# EAGLE design PowerMeterShield (EAGLE 6.5.0)
Assembly variants: ISOLATED, NONISOLATED
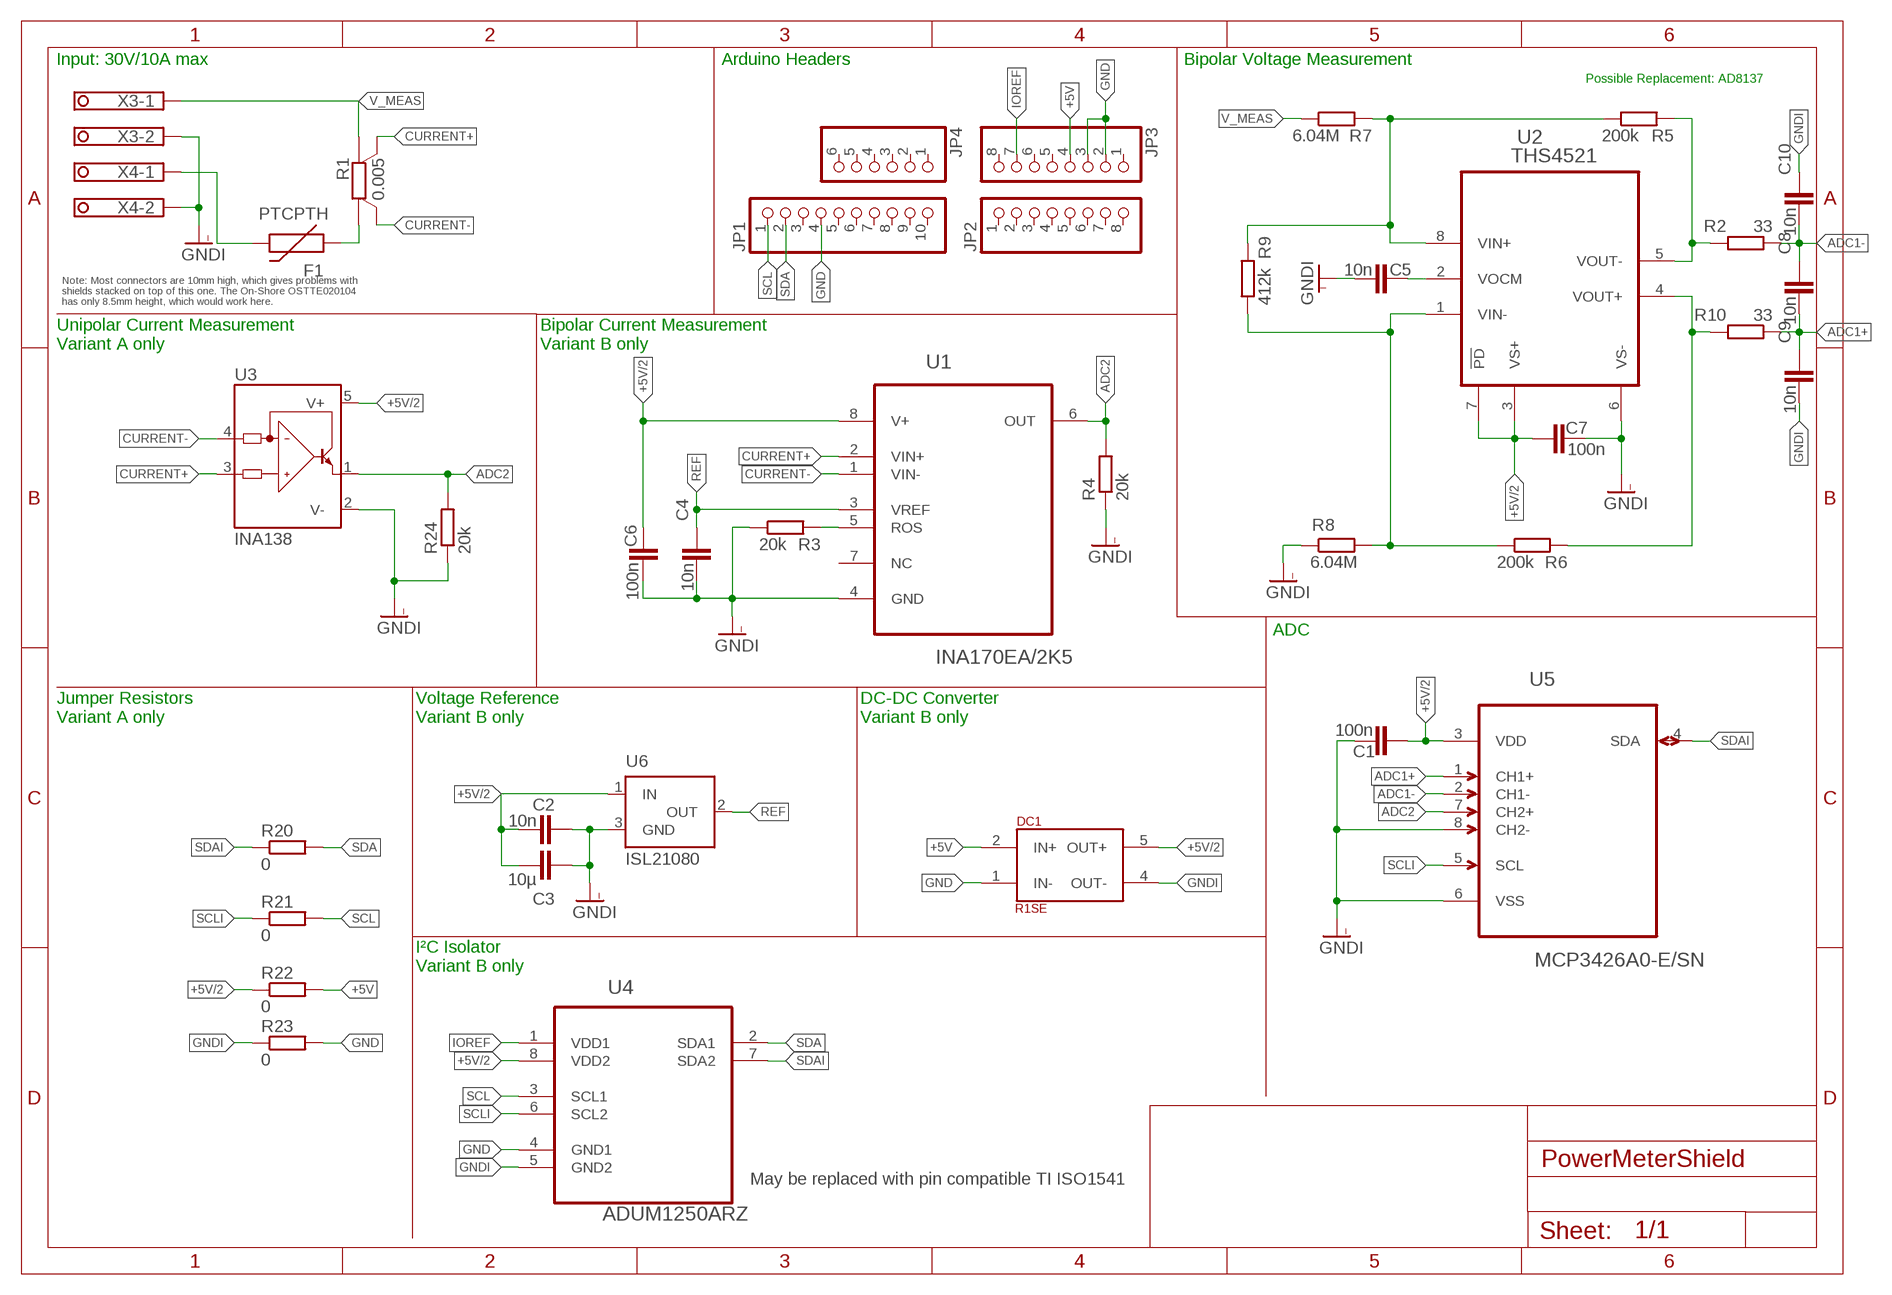
[diagram p0: schematic, sheet 1]

## Parts
C1  100n  C-EUC0805  [C0805]
C2  10n  C-EUC0805  [C0805]  (not fitted in variant NONISOLATED)
C3  10µ  C-EUC0805  [C0805]  (not fitted in variant NONISOLATED)
C4  10n  C-EUC0805  [C0805]  (not fitted in variant NONISOLATED)
C5  10n  C-EUC0805  [C0805]
C6  100n  C-EUC0805  [C0805]  (not fitted in variant NONISOLATED)
C7  100n  C-EUC0805  [C0805]
C8  10n  C-EUC0805  [C0805]
C9  10n  C-EUC0805  [C0805]
C10  10n  C-EUC0805  [C0805]
DC1  R1SE  [R1SE]  (not fitted in variant NONISOLATED)
F1  PTCPTH  [PTC]
JP1  PINHD-1X10  [1X10]
JP2  PINHD-1X8  [1X08]
JP3  PINHD-1X8  [1X08]
JP4  PINHD-1X6  [1X06]
R1  0.005  SHUNT-4CSM3675M  [CSM3637M]
R2  33  R-EU_R0805  [R0805]
R3  20k  R-EU_R0805  [R0805]  (not fitted in variant NONISOLATED)
R4  20k  R-EU_R0805  [R0805]  (not fitted in variant NONISOLATED)
R5  200k  R-EU_R0805  [R0805]
R6  200k  R-EU_R0805  [R0805]
R7  6.04M  R-EU_R0805  [R0805]
R8  6.04M  R-EU_R0805  [R0805]
R9  412k  R-EU_R0805  [R0805]
R10  33  R-EU_R0805  [R0805]
R20  0  R-EU_R2010  [R2010]  (not fitted in variant ISOLATED)
R21  0  R-EU_R2010  [R2010]  (not fitted in variant ISOLATED)
R22  0  R-EU_R2010  [R2010]  (not fitted in variant ISOLATED)
R23  0  R-EU_R2010  [R2010]  (not fitted in variant ISOLATED)
R24  20k  R-EU_R0805  [R0805]  (not fitted in variant ISOLATED)
U1  INA170EA/2K5  [SOP65P490X110-8N]  (not fitted in variant NONISOLATED)
U2  THS4521  THS4531AID  [SOIC127P600X175-8N]
U3  INA138  [SOT23-5]  (not fitted in variant ISOLATED)
U4  ADUM1250ARZ  [SOIC127P600X175-8N]  (not fitted in variant NONISOLATED)
U5  MCP3426A0-E/SN  [SOIC127P600X175-8N]
U6  ISL21080  MAX6520  [SOT23]  (not fitted in variant NONISOLATED)
X3  1751248  [1751248]
X4  1751248  [1751248]

## Nets
+5V: DC1.2(IN+) JP3.4 R22.2
+5V/2: C1.1 C2.1 C3.1 C6.1 C7.1 DC1.5(OUT+) R22.1 U1.8(V+) U2.3(VS+) U2.7(!PD) U3.5(V+) U4.8(VDD2) U5.3(VDD) U6.1(IN)
ADC1+: C8.1 C9.2 R10.1 U5.1(CH1+)
ADC1+_OLD: R6.2 R10.2 U2.4(VOUT+)
ADC1-: C8.2 C10.1 R2.1 U5.2(CH1-)
ADC1-_OLD: R2.2 R5.2 U2.5(VOUT-)
ADC2: R4.2 R24.2 U1.6(OUT) U3.1(OUT) U5.7(CH2+)
CURRENT+: R1.S2 U1.2(VIN+) U3.3(IN+)
CURRENT-: R1.S1 U1.1(VIN-) U3.4(IN-)
GND: DC1.1(IN-) JP1.4 JP3.2 JP3.3 R23.2 U4.4(GND1)
GNDI: C1.2 C2.2 C3.2 C4.1 C5.1 C6.2 C7.2 C9.1 C10.2 DC1.4(OUT-) R3.1 R4.1 R8.1 R23.1 R24.1 U1.4(GND) U2.6(VS-) U3.2(V-) U4.5(GND2) U5.6(VSS) U5.8(CH2-) U6.3(GND) X3.2 X4.2
IOREF: JP3.7 U4.1(VDD1)
N$1: C5.2 U2.2(VOCM)
N$2: R5.1 R7.2 R9.2 U2.8(VIN+)
N$3: F1.P$1 R1.I1
N$7: R3.2 U1.5(ROS)
N$10: R6.1 R8.2 R9.1 U2.1(VIN-)
REF: C4.2 U1.3(VREF) U6.2(OUT)
SCL: JP1.1 R21.2 U4.3(SCL1)
SCLI: R21.1 U4.6(SCL2) U5.5(SCL)
SDA: JP1.2 R20.2 U4.2(SDA1)
SDAI: R20.1 U4.7(SDA2) U5.4(SDA)
V_MEAS [highpower]: R1.I2 R7.1 X3.1
VIN_MEAS [highpower]: F1.P$2 X4.1
Unconnected: JP1.3 JP1.5 JP1.6 JP1.7 JP1.8 JP1.9 JP1.10 JP2.1 JP2.2 JP2.3 JP2.4 JP2.5 JP2.6 JP2.7 JP2.8 JP3.1 JP3.5 JP3.6 JP3.8 JP4.1 JP4.2 JP4.3 JP4.4 JP4.5 JP4.6 U1.7(NC)

## Notes on the sheet
- Input: 30V/10A max | Arduino Headers | Bipolar Voltage Measurement
- Possible Replacement: AD8137
- Note: Most connectors are 10mm high, which gives problems with
  shields stacked on top of this one. The On-Shore OSTTE020104
  has only 8.5mm height, which would work here.
- Unipolar Current Measurement
  Variant A only
- Bipolar Current Measurement
  Variant B only
- ADC
- Jumper Resistors
  Variant A only
- Voltage Reference
  Variant B only
- DC-DC Converter
  Variant B only
- I²C Isolator
  Variant B only
- May be replaced with pin compatible TI ISO1541

## Library data of the parts
C1-C10 = rcl:C-EU: CAPACITOR, European symbol; OC_FARNELL: 2310707; PRICE_100: 0.005
DC1 = R1SE:R1SE; OC_DIGIKEY: 945-1659-1-ND; PRICE_10: 3.08; PRICE_100: 2.82
F1 = SparkFun:PTC: Resettable Fuse PTC Resettable Fuse. Spark Fun Electronics SKU : COM-08357; OC_DIGIKEY: RGEF1000-ND; PRICE_10: 0.59; PRICE_100: 0.53
JP1 = pinhead:PINHD-1X10: PIN HEADER; OC_ELECTRODRAGON: CCO3507; PRICE_10: 0.16; PRICE_100: 0.16
JP2 JP3 = pinhead:PINHD-1X8: PIN HEADER; OC_ELECTRODRAGON: CCO3509; PRICE_10: 0.12; PRICE_100: 0.12
JP4 = pinhead:PINHD-1X6: PIN HEADER; OC_ELECTRODRAGON: CCO3510; PRICE_10: 0.12; PRICE_100: 0.12
R1 = R-Vishay:SHUNT-4; OC_FARNELL: 1107419RL; PRICE_10: 0.90; PRICE_100: 0.78
R2 R9 R10 = rcl:R-EU_: RESISTOR, European symbol; OC_DIGIKEY: 311-412KCRCT-ND; PRICE_10: 0.015; PRICE_100: 0.0071
R3 R4 R24 = rcl:R-EU_: RESISTOR, European symbol; OC_FARNELL: 2129219; PRICE_5000: 0.001
R5 R6 = rcl:R-EU_: RESISTOR, European symbol; OC_FARNELL: 2129299; PRICE_5000: 0.001
R7 = rcl:R-EU_: RESISTOR, European symbol; OC_DIGIKEY: 311-6.04MCRCT-ND; PRICE_10: 0.013; PRICE_100: 0.008
R8 = rcl:R-EU_: RESISTOR, European symbol; OC_DIGIKEY: 311-6.04MCRCT-ND; PRICE_10: 0.013; PRICE_100: 0.0083
R20 = rcl:R-EU_: RESISTOR, European symbol; OC_DIGIKEY: 1276-5994-1-ND; OC_TME: SMD2010-0R; PRICE_10: 0.08; PRICE_100: 0.034
R21 R22 = rcl:R-EU_: RESISTOR, European symbol; OC_DIGIKEY: 1276-5994-1-ND; PRICE_10: 0.082; PRICE_100: 0.034
R23 = rcl:R-EU_: RESISTOR, European symbol; OC_DIGIKEY: 1276-5994-1-ND; PRICE_10: 0.082; PRICE_100: 0.032
U1 = INA170:INA170EA/2K5: Bidirectional CURRENT SHUNT MONITOR; MPN: INA170EA/2K5; OC_DIGIKEY: INA170EA/2K5CT-ND; OC_FARNELL: 1234851; OC_NEWARK: 74C9832; PACKAGE: MSOP-8; PRICE_10: 1.85; PRICE_100: 0.92; REMARK: USE DIGIKEY FOR 100; SUPPLIER: Texas Instruments
U2 = THS4531:THS4531AID: Ultra Low Power, Rail-to-Rail Output, Fully-Differential Amplifier,SOIC-8; MPN: THS4531AID; OC_DIGIKEY: 296-35973-1-ND; OC_FARNELL: 1755708; OC_NEWARK: 55W7338; PACKAGE: SOIC- 8; PRICE_10: 1.81; PRICE_100: 1.17; REMARK: USE DIGIKEY FOR 100; SUPPLIER: TEXAS INSTRUMENTS
U3 = burr-brown:INA138: High-Side Measurement Current Shunt Monitor; MF: TEXAS INSTRUMENTS; MPN: INA138NA/250; OC_DIGIKEY: 296-17936-1-ND; OC_FARNELL: 1564888; OC_NEWARK: 80K5906; PRICE_10: 1.15; PRICE_100: 0.63; REMARK: USE DIGIKEY FOR 100
U4 = Adum1250:ADUM1250ARZ: Hot Swappable, Dual I2C Isolators; MPN: ADUM1250ARZ; OC_DIGIKEY: 296-34872-1-ND; OC_FARNELL: 1814353; OC_NEWARK: 27M9880; PACKAGE: SOIC-8; PRICE_10: 3.33; PRICE_100: 1.74; SUPPLIER: Analog Devices
U5 = MCP3428:MCP3426A0-E/SN: Analog-to-Digital Converter; MPN: MCP3426A0-E/SN; OC_DIGIKEY: MCP3426A0-E/SN-ND; OC_FARNELL: 1825012; OC_NEWARK: 52R9954; PACKAGE: SOIC-8; PRICE_10: 2.06; PRICE_100: 1.58; SUPPLIER: Microchip
U6 = maxim:MAX6520: 1.2V Voltage Reference 50ppm/°C, SOT23, 3-Terminal Source: Data sheet <http://datasheets.maxim-ic.com/en/ds/MAX6520.pdf>; MF: MAXIM; MPN: MAX6520EUR-T; OC_DIGIKEY: ISL21080DIH310Z-TKCT-ND; OC_FARNELL: unknown; OC_NEWARK: 02J4586; PRICE_10: 1.35; PRICE_100: 0.81
X3 X4 = con-phoenix-350:1751248: MKDS 1/ 2-3,5 Printklemme Nennstrom: 10 A Bemessungsspannung: 160 V Raster: 3,5 mm Polzahl: 2 Montageart: Löten Anschlussart: Schraubanschluss Anschlussrichtung vom Leiter zur Platine: 0° Source: http://eshop.phoenixcontact.com .. 1751248.pdf; OC_DIGIKEY: ED2740-ND; OC_FARNELL: unknown; OC_NEWARK: unknown; PRICE_10: 0.27; PRICE_100: 0.19

## Net classes
1 highpower: width 0.305 mm, clearance 0.381 mm
2 isolated: clearance 20 mm

## Board
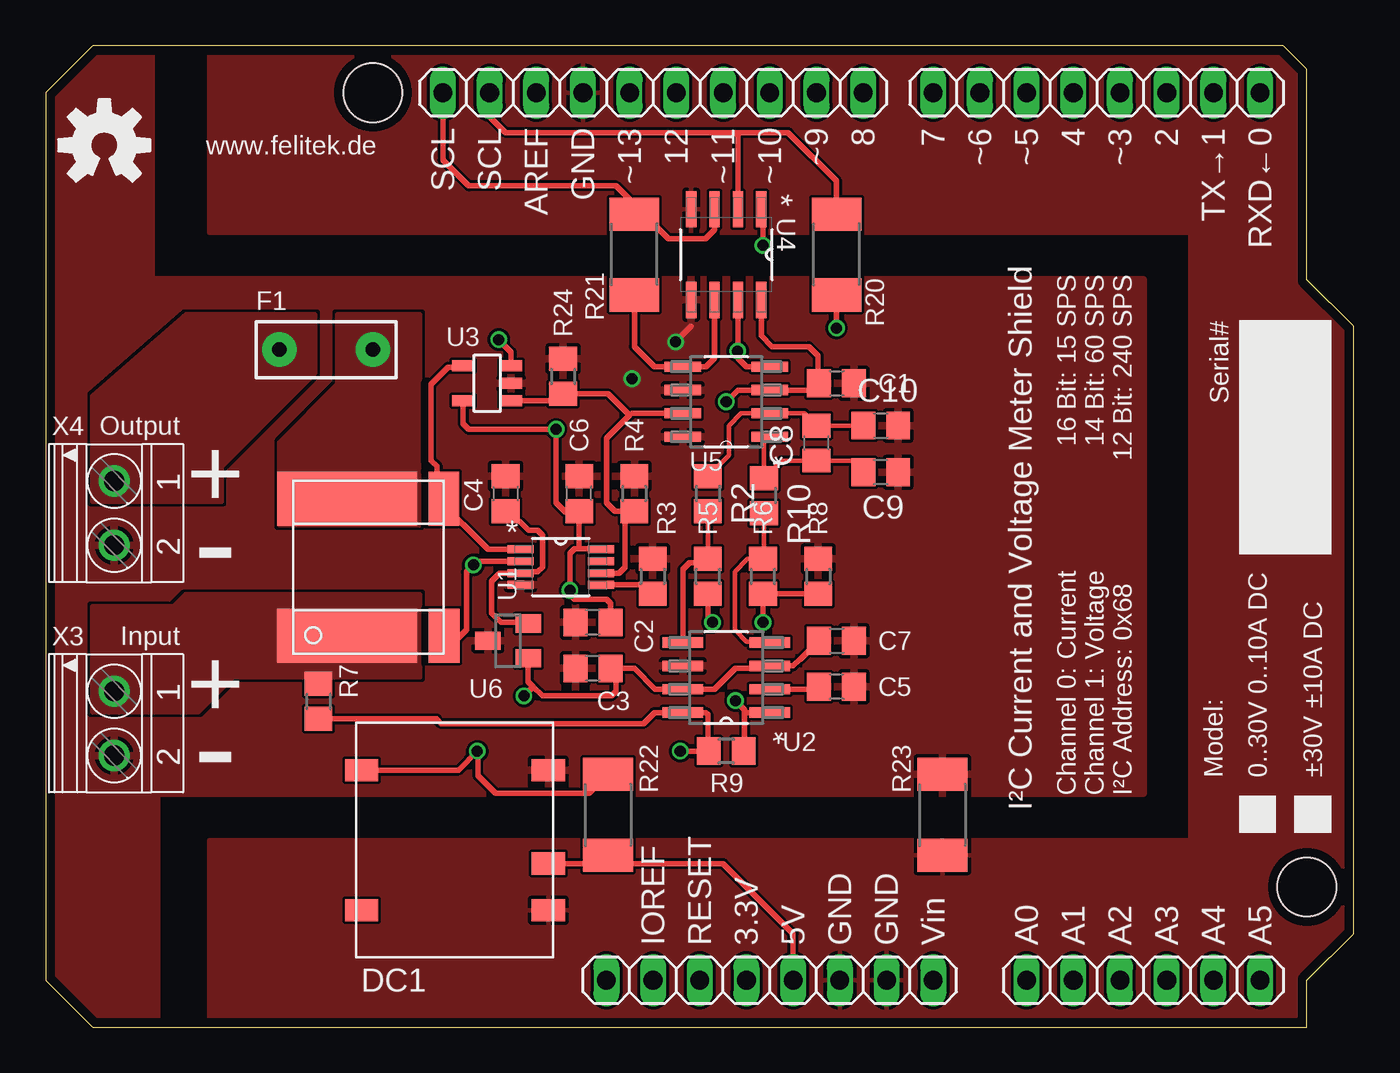
[diagram p1: board, top side]
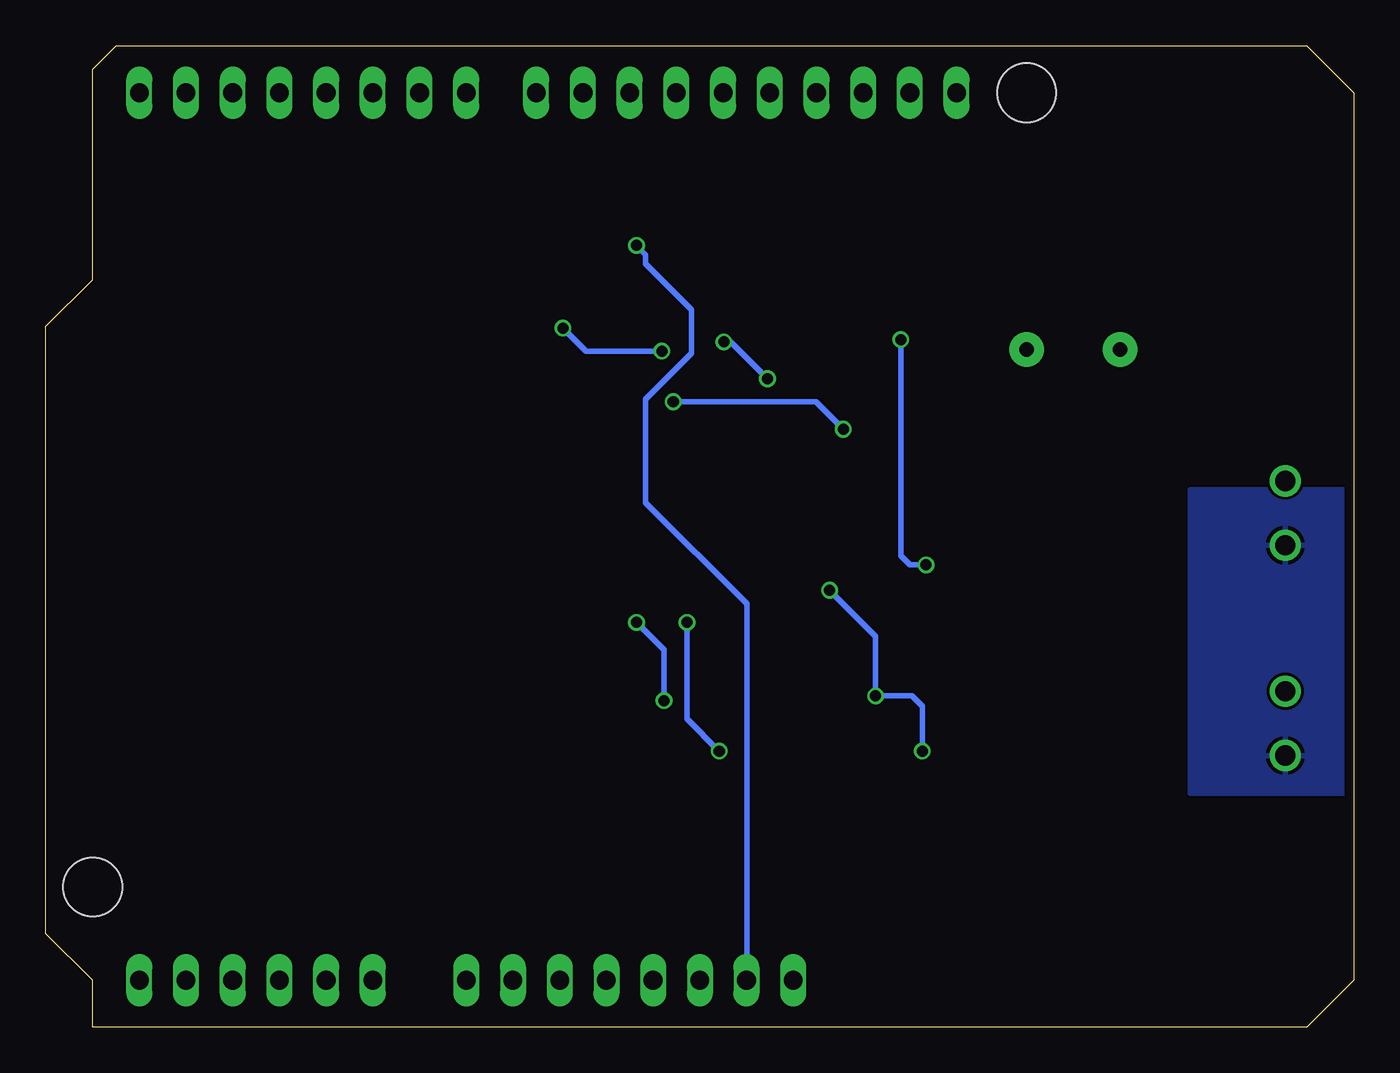
[diagram p2: board, bottom side, seen from below]

Size 71.12 x 53.34 mm. Coordinates in mm from the lower left corner, seen from the top.
Outline: 2.54,0 68.58,0 68.58,2.54 71.12,5.08 71.12,38.1 68.58,40.64 68.58,52.07 67.31,53.34 2.54,53.34 0,50.8 0,2.54 2.54,0
Copper layers (1*16): Top 0.035mm / dielectric 1.5mm / Bottom 0.035mm
Design rules "aetzwerk *": minimum track width 6mil, minimum drill 12mil, track to track 6mil, track to pad 6mil, pad to pad 6mil, via to via 6mil, smd to smd 6mil, copper to edge 20mil, drill to drill 8mil, minimum pad ring 8mil, minimum via ring 6mil, stop-mask expansion 3mil, vias tented up to drill 0mil, thermal gap 8mil
Holes 3.2 mm at 17.78,50.8 68.58,7.62
bKeepout: area 0,32.4 to 9.5,43.8; area 0,3.2 to 11.4,12.1

### Footprints (pad centres in the part's own frame; a part is rotated, then mirrored left to right if it is on the bottom)
C0805 = smd 1.3 x 1.5: 1 -0.95,0; 2 0.95,0
R1SE = smd 1.2 x 1.8: 1 -3.81,-5.1; 2 -1.27,-5.1; 4 3.81,-5.1; 5 3.81,5.06; 8 -3.81,5.06
PTC = drill 0.8 pad 1.88: P$1 -2.54,0; P$2 2.54,0
1X10 = drill 1.016 long: 1 -11.43,0; 2 -8.89,0; 3 -6.35,0; 4 -3.81,0; 5 -1.27,0; 6 1.27,0; 7 3.81,0; 8 6.35,0; 9 8.89,0; 10 11.43,0
1X08 = drill 1.016 long: 1 -8.89,0; 2 -6.35,0; 3 -3.81,0; 4 -1.27,0; 5 1.27,0; 6 3.81,0; 7 6.35,0; 8 8.89,0
1X06 = drill 1.016 long: 1 -6.35,0; 2 -3.81,0; 3 -1.27,0; 4 1.27,0; 5 3.81,0; 6 6.35,0
CSM3637M = smd 7.62 x 2.95: I1 -1.15,3.725; I2 -1.15,-3.725 | smd 1.68 x 2.95: S1 4.1,3.725; S2 4.125,-3.725
R0805 = smd 1.3 x 1.5: 1 -0.95,0; 2 0.95,0
R2010 = smd 1.8 x 2.7: 1 -2.2,0; 2 2.2,0
SOP65P490X110-8N = smd 1.422 x 0.432: 1 -2.184,0.965; 2 -2.184,0.33; 3 -2.184,-0.33; 4 -2.184,-0.965; 5 2.184,-0.965; 6 2.184,-0.33; 7 2.184,0.33; 8 2.184,0.965
SOIC127P600X175-8N = smd 2.184 x 0.559: 1 -2.362,1.905; 2 -2.362,0.635; 3 -2.362,-0.635; 4 -2.362,-1.905; 5 2.362,-1.905; 6 2.362,-0.635; 7 2.362,0.635; 8 2.362,1.905
SOT23-5 = smd 0.6 x 1.2: 1 -0.95,-1.306; 2 0,-1.306; 3 0.95,-1.306; 4 0.95,1.306; 5 -0.95,1.306
SOIC127P600X175-8N' = smd 1.981 x 0.559: 1 -2.464,1.905; 2 -2.464,0.635; 3 -2.464,-0.635; 4 -2.464,-1.905; 5 2.464,-1.905; 6 2.464,-0.635; 7 2.464,0.635; 8 2.464,1.905
SOIC127P600X175-8N'' = smd 1.981 x 0.559: 1 -2.362,1.905; 2 -2.362,0.635; 3 -2.362,-0.635; 4 -2.362,-1.905; 5 2.362,-1.905; 6 2.362,-0.635; 7 2.362,0.635; 8 2.362,1.905
SOT23 = smd 1 x 1.4: 1 -0.95,-1.1; 2 0.95,-1.1; 3 0,1.1
1751248 = drill 1.1 pad 1.7: 1 -1.75,-0.1; 2 1.75,-0.1

### Placement (x,y rotation side)
C1  43,35 0 top
C2  29.75,22 180 top
C3  29.75,19.5 180 top
C4  25,29 270 top
C5  43,18.5 180 top
C6  29,29 90 top
C7  43,21 0 top
C8  41.91,31.75 90 top
C9  45.4,30.16 180 top
C10  45.4,32.7 0 top
DC1  22.23,10.16 90 top
F1  15.24,36.83 180 top
JP1  33.02,50.8 0 top
JP2  57.15,50.8 0 top
JP3  39.37,2.54 180 top
JP4  59.69,2.54 0 top
R1  17.54,25 0 top
R2  36,29 270 top
R3  33,24.5 270 top
R4  32,29 270 top
R5  36,24.5 90 top
R6  39,24.5 90 top
R7  14.82,17.7 270 top
R8  42,24.5 270 top
R9  37,15 180 top
R10  39.05,28.89 270 top
R20  43,42 90 top
R21  32,42 90 top
R22  30.57,11.54 270 top
R23  48.76,11.54 270 top
R24  28.12,35.38 270 top
U1  28,25 0 top
U2  37,19 180 top
U3  24,35 90 top
U4  ADUM1250ARZ  [SOIC127P600X175-8N']  37,42 270 top
U5  MCP3426A0-E/SN  [SOIC127P600X175-8N'']  37,34 180 top
U6  25.14,21 90 top
U$1  [OSHW-LOGO-M]  3.17,47.94 0 top
X3  3.81,16.51 270 top
X4  3.81,27.94 270 top

### Tracks (layer width: path | path; a pad name or v marks a point on that pad's centre or on a via)
+5V
  Top 0.305: JP3.4 40.64,5.08 36.83,8.89 30.48,8.89 | 30.48,8.89 DC1.2 | R22.2 30.57,8.98 30.48,8.89
+5V/2  (via drill 0.6)
  Top 0.305: 29,26 C6.1 28.95,28 28.25,28 27.75,28.5 v27.75,32.5 23,32.5 22.69,32.81 U3.5 | U1.8 30.15,26 29,26 | C7.1 41.05,20 41,20 40.63,19.64 U2.3 39.23,19.5 37.5,19.5 36.37,18.36 U2.7 33.13,18.36 32,19.5 C3.1 30.75,19.45 31,19.45 31,18.25 30.75,18 27,18 26.5,18.5 | v37,34 37.63,34.63 U5.3 41.69,34.63 C1.1 42,35.05 42,36.5 41.5,37 39.5,37 38.91,37.59 U4.8 | C2.1 30.7,23.05 30.5,23.25 28.75,23.25 28.5,23.5 v28.5,23.75 28.5,25.75 28.75,26 29,26 | v26,18 26.5,18.5 | U6.1 26.23,18.77 26.5,18.5 | DC1.5 22.43,13.97 v23.46,15 23.5,14.96 23.5,13.65 24.45,12.7 29.53,12.7 R22.1
  Bottom 0.305: v37,34 29.25,34 v27.75,32.5 | v28.5,23.75 26,21.25 v26,18 24.03,18 23.46,17.43 v23.46,15
ADC1+
  Top 0.254: U5.1 39.05,31.79 R10.1 40.01,30.8 C8.1 43.81,30.8 C9.2
ADC1+_OLD
  Top 0.254: R10.2 39.05,25.5 R6.2 38.15,25.45 37.47,24.77 37.47,21.59 38.1,20.95 39.31,20.95 U2.4
ADC1-
  Top 0.254: C10.1 C8.2 41.24,33.37 U5.2 37.81,33.37 37.15,32.7 37.15,31.1 R2.1
ADC1-_OLD
  Top 0.254: R5.2 R2.2
  Top 0.305: U2.5 34.64,24.89 35,25.25 35.8,25.25 R5.2
ADC2
  Top 0.305: U1.6 31.17,24.67 31.5,25 31.5,27.55 R4.2 30.95,28.05 30.5,28.5 30.5,32 31.75,33.25 | 31.75,33.25 31.86,33.37 U5.7 | U3.1 27.75,34.05 R24.2 30.57,34.42 31.75,33.25
CURRENT+  (via drill 0.6)
  Top 0.305: U3.3 25.31,36.69 v24.62,37.38 | U1.2 23.45,25.33 v23.25,25.12 22.88,24.75 22.88,21.61 22.23,20.95 21.98,20.95 R1.S2
  Bottom 0.305: v24.62,37.38 24.62,25.62 24.12,25.12 v23.25,25.12
CURRENT-
  Top 0.305: R1.S1 21.27,28.73 | 21.27,28.73 24.04,25.96 U1.1 | U3.4 22.62,35.88 21.88,35.88 20.95,34.95 20.95,30.8 21.27,30.48 21.27,28.73
GND
  pour Top: 62.23,43.18 8.89,43.18 8.89,53.34 67.31,53.34 68.58,52.07 68.58,40.64 71.12,38.1 71.12,5.08 68.58,2.54 68.58,0 8.89,0 8.89,10.16 62.23,10.16
GNDI  (via drill 0.6)
  Top 0.305: 35.09,38.09 v34.25,37.25 | 34.52,34.75 U5.6
  Bottom 0.305: v34.25,37.25 33.88,37.25 v31.88,35.25
  pour Top (rank 3): 0,2.54 0,50.8 2.54,53.34 5.71,53.34 5.71,40.64 59.69,40.64 59.69,12.7 6.03,12.7 6.03,0 3.81,0
  pour Bottom: 8.89,12.7 8.89,29.21 0,29.21 0,12.7
IOREF  (via drill 0.6)
  Top 0.305: v39,42.5 39,44.37 U4.1
  Bottom 0.305: JP3.7 33,2.56 33,23 38.5,28.5 38.5,34.12 36,36.62 36,39 38.5,41.5 38.5,42 v39,42.5
N$1
  Top 0.305: U2.2 41.91,18.36 C5.2
N$2  (via drill 0.6)
  Top 0.305: R5.1 36,22.25 v36.25,22 | v34.5,15 R9.2 36,15.05 36,17 35.91,17.09 U2.8 33.09,17.09 32.5,16.5 21.5,16.5 21.25,16.75 R7.2
  Bottom 0.305: v36.25,22 36.25,16.75 v34.5,15
N$3
  pour Top (isolate 0.406, rank 2, no thermals): 15.88,38.73 15.88,34.92 12.7,31.75 12.7,27.3 20.32,27.3 20.32,38.73
N$7
  Top 0.305: U1.5 32.52,24.04 R3.2
N$10  (via drill 0.6)
  Top 0.305: U2.1 38.09,17.09 38,17 | 38,17 38,15.05 R9.1 | 42.05,23.5 R8.2 R6.1 v39,22 | 38,17 38,17.25 v37.5,17.75
  Bottom 0.305: v37.5,17.75 37.5,20.5 v39,22
REF
  Top 0.305: C4.2 25.2,28.05 26.25,27 26.75,27 27,26.75 27,25 26.75,24.75 25.9,24.75 U1.3 24.67,24.67 24.25,24.25 24.25,22.5 24.75,22 26.18,22 U6.2
SCL
  Top 0.305: JP1.1 21.59,47.14 23,45.73 31,45.73 32,44.73 | R21.2 32,44.73 | U4.3 36.37,43.35 35.88,42.86 33.87,42.86 32,44.73
SCLI
  Top 0.305: R21.1 32,37 33.09,35.91 U5.5 35.91,35.91 36.37,36.37 U4.6
SDA
  Top 0.305: 37.47,48.63 40.37,48.63 43,46 R20.2 | 37.47,48.63 25,48.63 24.13,49.51 JP1.2 | U4.2 37.63,48.47 37.47,48.63
SDAI  (via drill 0.6)
  Top 0.305: U5.4 38.09,35.91 37.63,36.37 37.63,36.74 | v43,38 R20.1 | 37.63,36.74 v37.62,36.75 | 37.63,36.74 37.63,39.52 | 37.63,39.52 37.62,39.53 | 37.63,39.52 U4.7
  Bottom 0.305: v37.62,36.75 41.75,36.75 v43,38
V_MEAS
  pour Top (isolate 0.406, no thermals): 20.32,19.05 20.32,23.5 7.62,23.5 6.99,22.86 2.54,22.86 2.54,17.14 8.26,17.14 10.16,19.05
VIN_MEAS
  pour Top (isolate 0.406, no thermals): 14.61,38.73 14.61,35.56 9.53,30.48 9.53,28.57 2.54,28.57 2.54,34.29 7.62,38.73

### Text on the board
tPlace: Output | I²C Current and Voltage Meter Shield | Input
tNames: SCL | SCL | AREF | GND | ~13 | 12 | ~11 | ~10 | ~9 | 8 | 7 | ~6 | ~5 | 4 | ~3 | 2 | TX→1 | RXD←0 | www.felitek.de | 16 Bit: 15 SPS / 14 Bit: 60 SPS / 12 Bit: 240 SPS | Serial# | + | - | + | - | Model: | 0..30V 0..10A DC | ±30V ±10A DC | Channel 0: Current / Channel 1: Voltage / I²C Address: 0x68 | IOREF | RESET | 3.3V | 5V | GND | GND | Vin | A0 | A1 | A2 | A3 | A4 | A5